# Altium schematic sheet LED.schdoc
size 127 x 99 mm
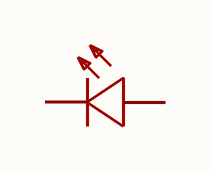
[diagram p0: LED.schdoc]

## Parts
LED?  LTST-C170KRKT  [LED0805-R-RD]  (value not drawn)

## Nets

Not connected (* = marked no-connect by the designer): LED? 1(+) 2(-)

## Library data of the parts
LED? = LTST-C170KRKT: Manufacturer: LITEON(光宝); Add into BOM: yes; Emitted Color: Red; Forward Voltage (VF): 2V; Power Dissipation: 75mW; Forward Current: 20mA; Dominant Wavelength: 631nm; Peak Wavelength: 639nm; Lens Color: Colorless Transparent Lens; Luminous Intensity: 54mcd; Viewing Angle: 130°; Symbol: LTST-C170KRKT; Device: LTST-C170KRKT; LCSC Part Name: LTST-C170KRKT; Supplier Part: C94868; Manufacturer Part: LTST-C170KRKT; Supplier Footprint: 0805; JLCPCB Part Class: Extended Part; Datasheet: https://atta.szlcsc.com/upload/public/pdf/source/20170325/1490427902593.pdf; Supplier: LCSC; Convert to PCB: yes; Diode Configuration: -; Color Temperature: -; Mounting Sytle: -; Operating Temperature: -55℃~+85℃